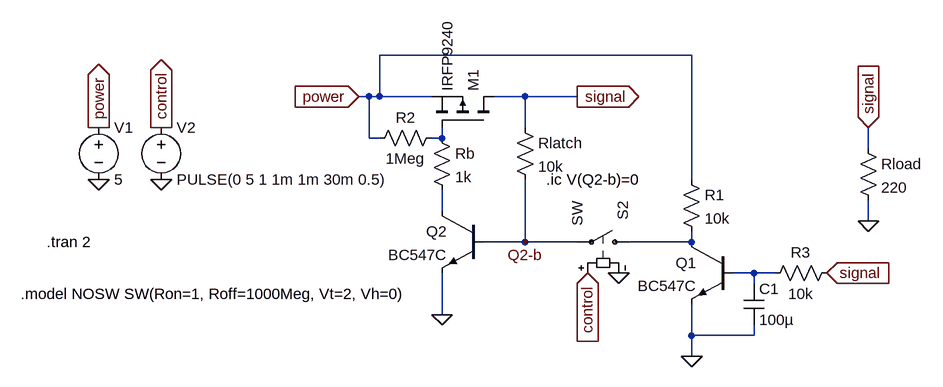
[diagram p0: schematic latch-toggle-npn-pmos-npn.asc]
latch-toggle-npn-pmos-npn.asc, the LTspice schematic file:
Version 4
SHEET 1 1248 680
WIRE 896 48 416 48
WIRE 400 112 384 112
WIRE 416 112 416 48
WIRE 416 112 400 112
WIRE 496 112 416 112
WIRE 640 112 592 112
WIRE 720 112 640 112
WIRE 640 160 640 112
WIRE 400 176 400 112
WIRE 416 176 400 176
WIRE 512 176 512 160
WIRE 512 176 496 176
WIRE 1168 192 1168 160
WIRE 896 240 896 48
WIRE 512 288 512 256
WIRE 1168 304 1168 272
WIRE 640 336 640 240
WIRE 640 336 576 336
WIRE 720 336 640 336
WIRE 896 336 896 320
WIRE 896 336 800 336
WIRE 992 384 960 384
WIRE 1024 384 992 384
WIRE 992 400 992 384
WIRE 512 448 512 384
WIRE 896 480 896 432
WIRE 992 480 992 464
WIRE 992 480 896 480
WIRE 896 512 896 480
FLAG 512 448 0
FLAG 384 112 power
IOPIN 384 112 In
FLAG 720 112 signal
IOPIN 720 112 Out
FLAG 1168 304 0
FLAG 1168 160 signal
IOPIN 1168 160 In
FLAG -16 240 0
FLAG -16 160 power
IOPIN -16 160 Out
FLAG 80 240 0
FLAG 80 160 control
IOPIN 80 160 Out
FLAG 640 336 Q2-b
FLAG 784 384 0
FLAG 736 384 control
IOPIN 736 384 In
FLAG 896 512 0
FLAG 1104 384 signal
IOPIN 1104 384 In
SYMBOL npn 576 288 M0
SYMATTR InstName Q2
SYMATTR Value BC547C
SYMBOL Res 624 144 R0
SYMATTR InstName Rlatch
SYMATTR Value 10k
SYMBOL Res 1152 176 R0
SYMATTR InstName Rload
SYMATTR Value 220
SYMBOL Voltage -16 144 R0
SYMATTR InstName V1
SYMATTR Value 5
SYMBOL Voltage 80 144 R0
SYMATTR InstName V2
SYMATTR Value PULSE(0 5 1 1m 1m 30m 0.5)
SYMBOL Res 496 160 R0
SYMATTR InstName Rb
SYMATTR Value 1k
SYMBOL sw 816 336 M270
WINDOW 0 34 26 Left 2
SYMATTR InstName S2
SYMATTR SpiceModel NOSW
SYMBOL Res 880 224 R0
SYMATTR InstName R1
SYMATTR Value 10k
SYMBOL pmos 592 160 M270
SYMATTR InstName M1
SYMATTR Value IRFP9240
SYMBOL Res 512 160 R90
WINDOW 0 0 56 VBottom 2
WINDOW 3 32 56 VTop 2
SYMATTR InstName R2
SYMATTR Value 1Meg
SYMBOL npn 960 336 M0
SYMATTR InstName Q1
SYMATTR Value BC547C
SYMBOL Cap 976 400 R0
SYMATTR InstName C1
SYMATTR Value 100µ
SYMBOL Res 1120 368 R90
WINDOW 0 0 56 VBottom 2
WINDOW 3 32 56 VTop 2
SYMATTR InstName R3
SYMATTR Value 10k
TEXT -136 416 Left 2 !.model NOSW SW(Ron=1, Roff=1000Meg, Vt=2, Vh=0)
TEXT -96 336 Left 2 !.tran 2
TEXT 672 240 Left 2 !.ic V(Q2-b)=0

The netlist it stands for:
* latch-toggle-npn-pmos-npn.asc
Q2 N002 Q2-b 0 0 BC547C
Rlatch signal Q2-b 10k
Rload signal 0 220
V1 power 0 5
V2 control 0 PULSE(0 5 1 1m 1m 30m 0.5)
Rb N001 N002 1k
S2 N003 Q2-b control 0 NOSW SW
R1 power N003 10k
M1 signal N001 power power IRFP9240
R2 N001 power 1Meg
Q1 N003 N004 0 0 BC547C
C1 N004 0 100µ
R3 signal N004 10k
.model NPN NPN
.model PNP PNP
.lib standard.bjt
.model NMOS NMOS
.model PMOS PMOS
.lib standard.mos
.model NOSW SW(Ron=1, Roff=1000Meg, Vt=2, Vh=0)
.tran 2
.ic V(Q2-b)=0
.backanno
.end